# Altium schematic sheet MIPI-DSI.SchDoc: Dahlia Carrier Board
size A3; Organization: Toradex AG; Address1: Ebenaustrasse 10; Address2: Horw; Address3: 6048; Address4: Switzerland; DocumentNumber: 10; Revision: V1.1; SheetNumber: 10; SheetTotal: 21; PageSetup: Record=PageOptions|CenterHorizontal=True|CenterVertical=True|PrintScale=0.71|XCorrection=1.00|YCorrection=1.00|PrintKind=1|BorderSize=5000000|LeftOffset=0|BottomOffset=0|Orientation=2|PaperLength=1000|PaperWidth=1000|Scale=100|PaperSource=15|PrintQuality=600|MediaType=1|DitherType=10|PaperKind=A4|PrintScaleMode=1
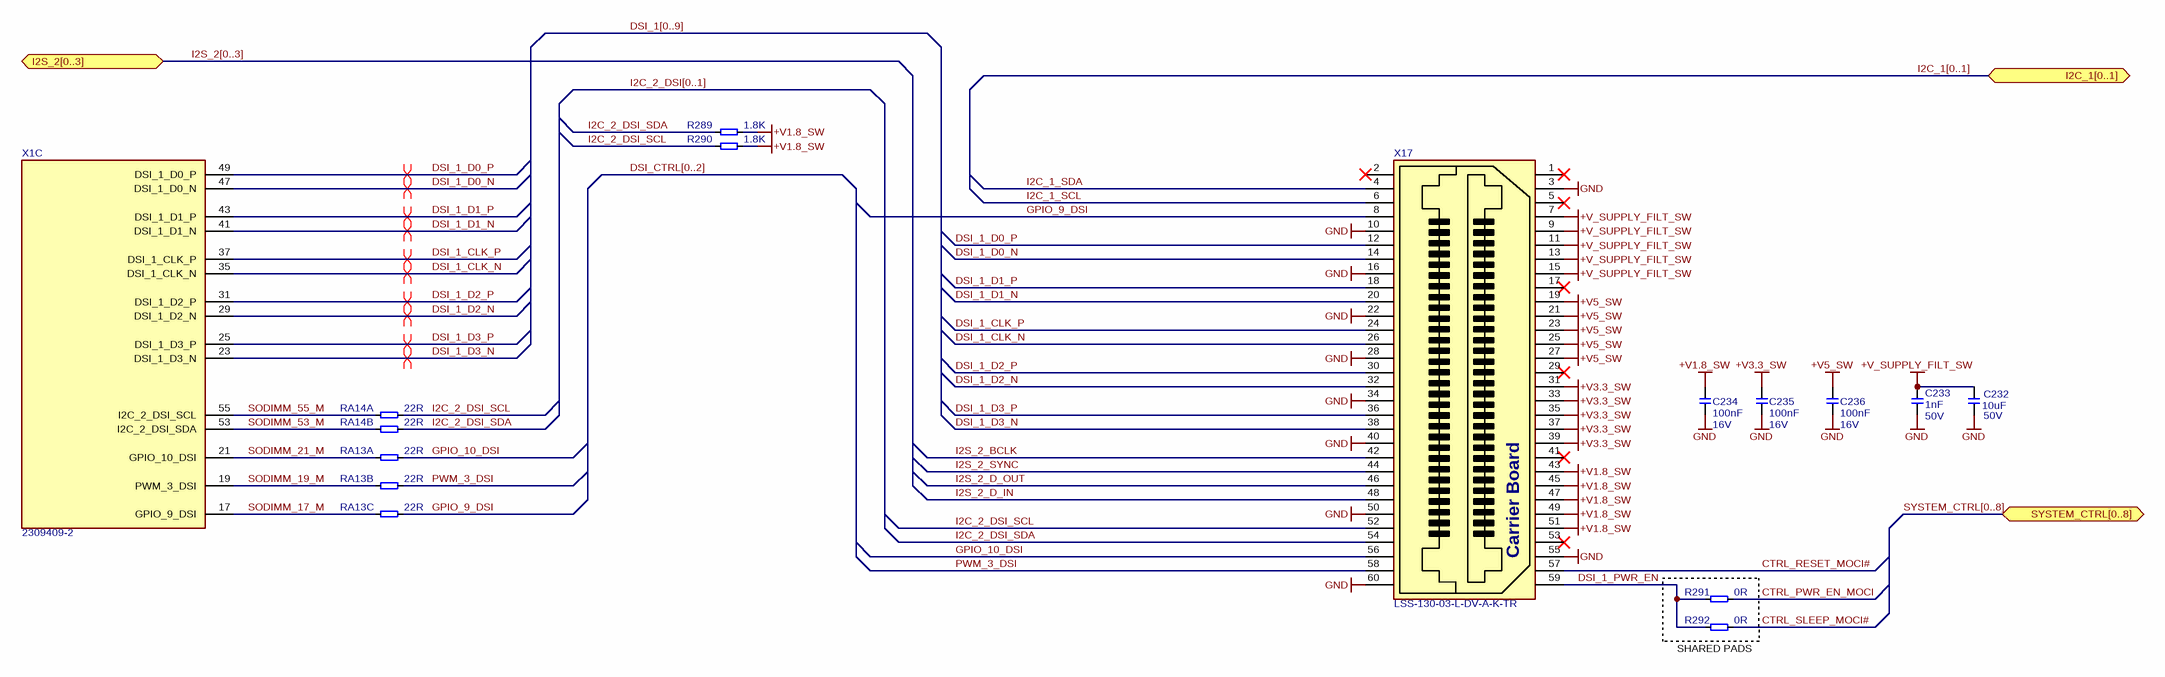
[diagram p0: MIPI-DSI.SchDoc]

## Parts
C232  Rating: 50V  [T_CAPC1206X60N]  (hidden comment: 10uF)
C233  Rating: 50V  [CAPC1005X60N]  (hidden comment: 1nF)
C234  Rating: 16V  [CAPC1005X60N]  (hidden comment: 100nF)
C235  Rating: 16V  [CAPC1005X60N]  (hidden comment: 100nF)
C236  Rating: 16V  [CAPC1005X60N]  (hidden comment: 100nF)
R289  1.8K  [RESC1005X40N]
R290  1.8K  [RESC1005X40N]
R291  0R  [T_RESC0603X30N]
R292  0R  [T_RESC0603X30N]
RA13  22R  [T_Resistor_Array_X4]  (parts A,B,C of 4)
RA14  22R  [T_Resistor_Array_X4]  (parts A,B of 4)
X1  2309409-2  [CON-TE-2309409-2-SOLDERABLE-STANDOFFS]  (part C of 23)
X17  LSS-130-03-L-DV-A-K-TR  [CON-SAMTEC-LSS-130-03-L-DV-A-CARRIER]

## Ports
I2C_1[0..1] (bidir), I2S_2[0..3] (bidir), SYSTEM_CTRL[0..8] (bidir)

## Nets
+V1.8_SW: C234.2 R289.1 R290.1 X17.43 X17.45 X17.47 X17.49 X17.51
+V3.3_SW: C235.2 X17.31 X17.33 X17.35 X17.37 X17.39
+V5_SW: C236.2 X17.19 X17.21 X17.23 X17.25 X17.27
+V_SUPPLY_FILT_SW: C232.2 C233.2 X17.7 X17.9 X17.11 X17.13 X17.15
GND: C232.1 C233.1 C234.1 C235.1 C236.1 X17.3 X17.10 X17.16 X17.22 X17.28 X17.34 X17.40 X17.50 X17.55 X17.60
CTRL_PWR_EN_MOCI: R291.2
CTRL_RESET_MOCI#: X17.57
CTRL_SLEEP_MOCI#: R292.2
DSI_1_CLK_N: X1.35(DSI_1_CLK_N) X17.26
DSI_1_CLK_P: X1.37(DSI_1_CLK_P) X17.24
DSI_1_D0_N: X1.47(DSI_1_D0_N) X17.14
DSI_1_D0_P: X1.49(DSI_1_D0_P) X17.12
DSI_1_D1_N: X1.41(DSI_1_D1_N) X17.20
DSI_1_D1_P: X1.43(DSI_1_D1_P) X17.18
DSI_1_D2_N: X1.29(DSI_1_D2_N) X17.32
DSI_1_D2_P: X1.31(DSI_1_D2_P) X17.30
DSI_1_D3_N: X1.23(DSI_1_D3_N) X17.38
DSI_1_D3_P: X1.25(DSI_1_D3_P) X17.36
DSI_1_PWR_EN: R291.1 R292.1 X17.59
GPIO_9_DSI: RA13.7 X17.8
GPIO_10_DSI: RA13.5 X17.56
I2C_1_SCL: X17.6
I2C_1_SDA: X17.4
I2C_2_DSI_SCL: R290.2 RA14.5 X17.52
I2C_2_DSI_SDA: R289.2 RA14.6 X17.54
I2S_2_BCLK: X17.42
I2S_2_D_IN: X17.48
I2S_2_D_OUT: X17.46
I2S_2_SYNC: X17.44
PWM_3_DSI: RA13.6 X17.58
SODIMM_17_M: RA13.3 X1.17(GPIO_9_DSI)
SODIMM_19_M: RA13.2 X1.19(PWM_3_DSI)
SODIMM_21_M: RA13.1 X1.21(GPIO_10_DSI)
SODIMM_53_M: RA14.2 X1.53(I2C_2_DSI_SDA)
SODIMM_55_M: RA14.1 X1.55(I2C_2_DSI_SCL)

Not connected (* = marked no-connect by the designer): X17 1* 2* 5* 17* 29* 41* 53*

## Buses and harness runs
bus DSI_1[0..9]
bus DSI_CTRL[0..2]
bus I2C_1[0..1] = port I2C_1[0..1]
bus I2C_2_DSI[0..1]
bus I2S_2[0..3] = port I2S_2[0..3]
bus SYSTEM_CTRL[0..8] = port SYSTEM_CTRL[0..8]

## Layout directives
differential pair; differential pair class DSI: DSI_1_CLK_N, DSI_1_CLK_P, DSI_1_D0_N, DSI_1_D0_P, DSI_1_D1_N, DSI_1_D1_P, DSI_1_D2_N, DSI_1_D2_P, DSI_1_D3_N, DSI_1_D3_P

## Notes on the sheet
- (near R292) SHARED PADS
- Title
- Size:
- Date:
- A3
- Number:
- Time:
- Revision:
- Sheet
- of
- File:
- (in symbol CON-Samtec-LSS-130-03-L-DV-A-K-TR-CARRIER) Carrier Board

## Library data of the parts
C232 = C-X5R-10uF-50V-20%-1206: Capacitor Ceramic X5R 10uF 50V 20% 1206; Tolerance: 20%; Type: X5R; Value: 10uF
C233 = C-X7R-1nF-50V-10%-0402: Capacitor Ceramic X7R 1nF 50V 10% 0402; Tolerance: 10%; Type: X7R; Value: 1nF
C234-C236 = C-X7R-100nF-16V-10%-0402: Capacitor Ceramic X7R 100nF 16V 10% 0402; Tolerance: 10%; Type: X7R; Value: 100nF
R289 R290 = R-1.8K-63mW-5%-0402: Resistor 1.8 Kohm 63mW 5% 0402; Rating: 63mW; Tolerance: 5%; Value: 1.8K
R291 R292 = R-0R-63mW-1%-0603: Resistor 0 ohm 63mW 1% 0603; Rating: 63mW; Tolerance: 1%; Value: 0R
RA13 RA14 = RA-22R-63mW-5%-1206-div: Resistor Array 22 R 63mW 5% 1206; Tolerance: 5%; Power Dissipation: 63mW; Value: 22R
X1 = CON-TE-2309409-2: DDR4 SODIMM Socket, 260 pins, 5.2mm(H), 0.5mm Pitch; Manufacturer Name: TE; Temperature Range: -40C to +125C; Package: DDR4-SODIMM-260; Manufacturer Part No.: 2309409-2
X17 = CON-Samtec-LSS-130-03-L-DV-A-K-TR-CARRIER: 60 Position Connector, Self Mating, Non-Gendered, Surface Mount; Manufacturer Name: Samtec; Pitch: 0.635mm; No. of ways: 60; Manufacturer Part No.: LSS-130-03-L-DV-A-K-TR